# EAGLE design Can_Van_Psa (EAGLE 9.5.1)

## Sheet 1 of 3
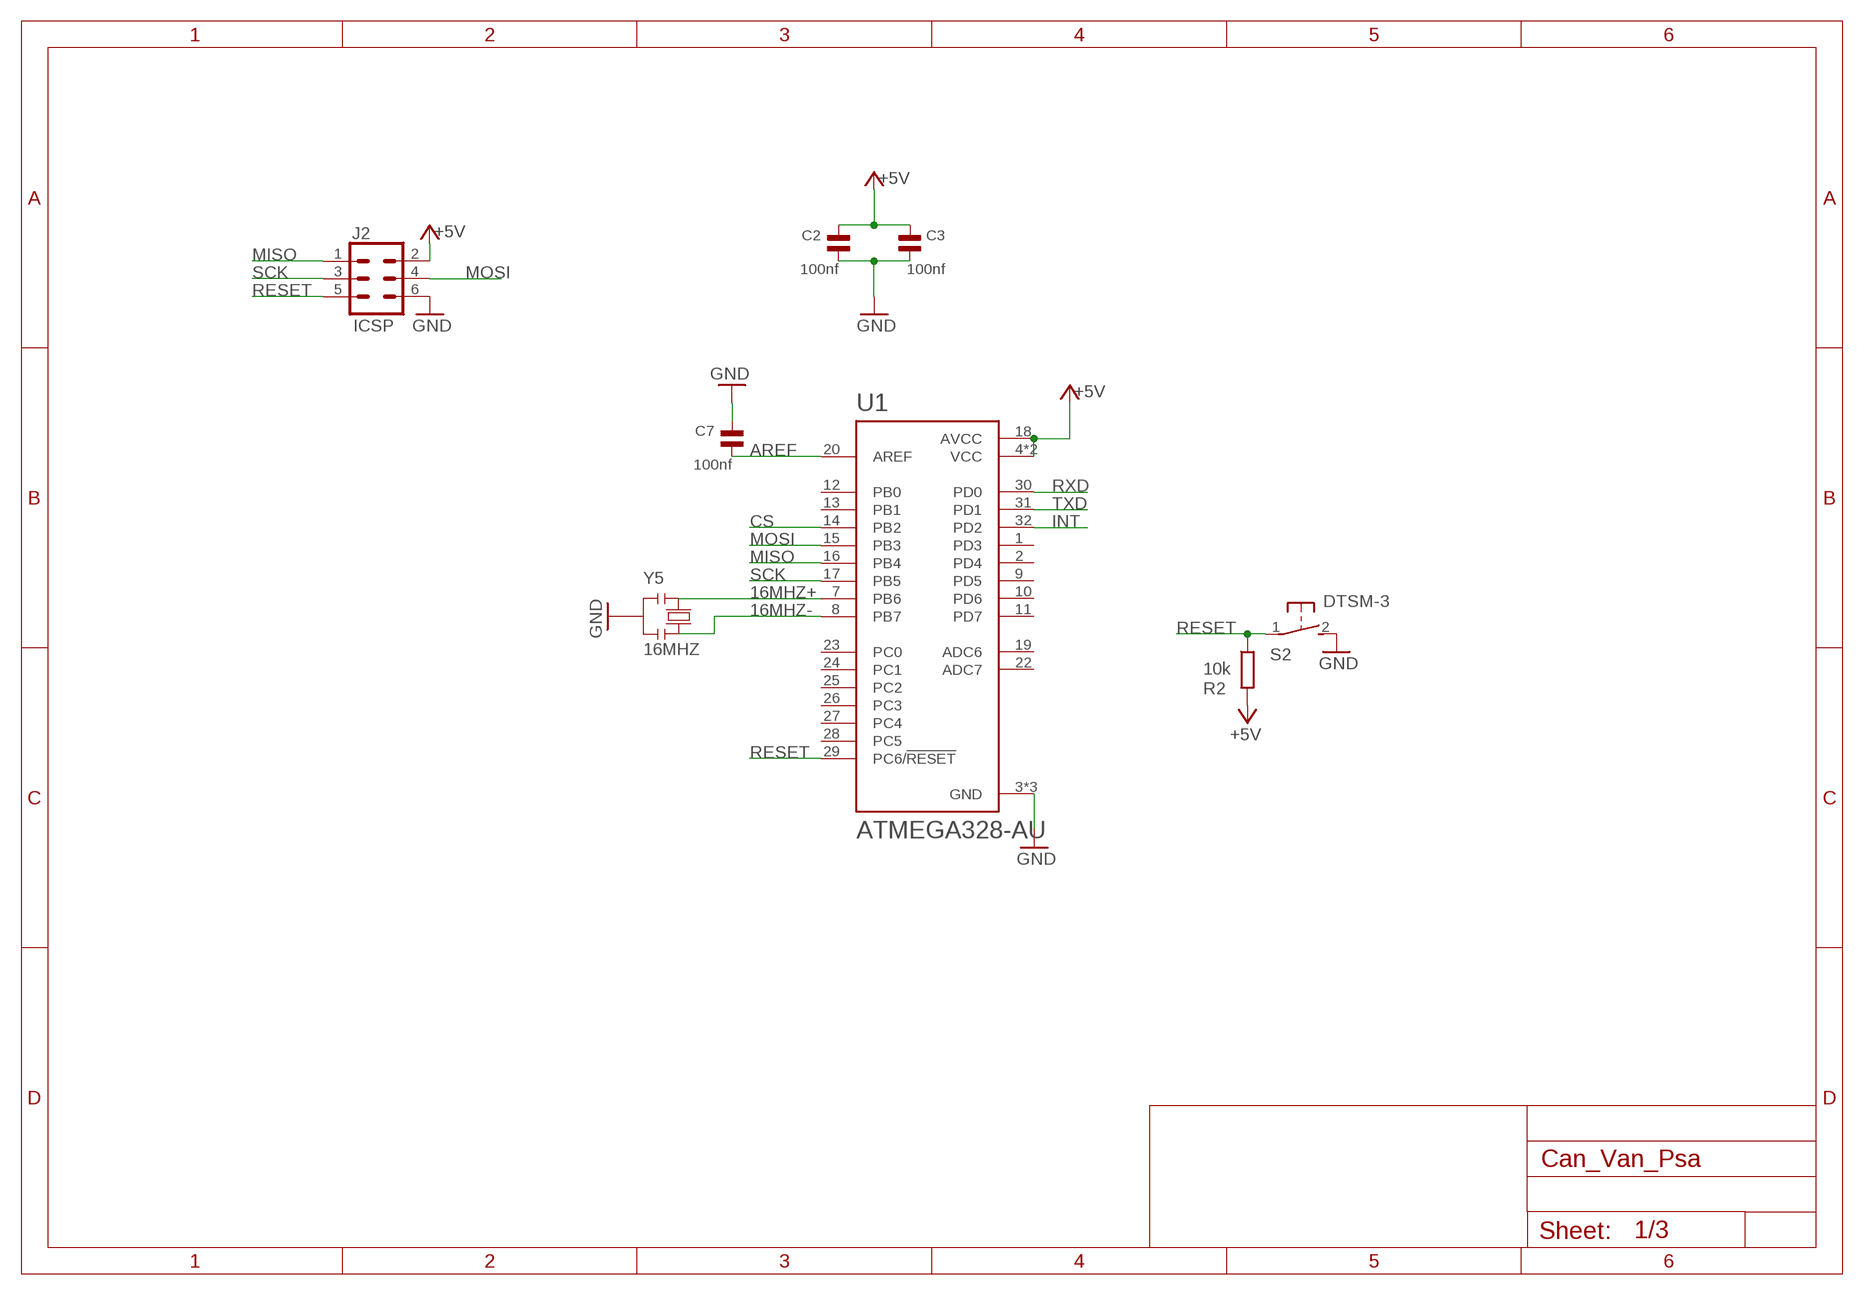
[diagram p0: schematic, sheet 1]

### Parts
C2  100nf  C0805  [0805]
C3  100nf  C0805  [0805]
C7  100nf  C0805  [0805]
J2  ICSP  CONN_03X22X3_SILK_MALE_PTH  [2X3]
R2  10k  R-EU_R0805  [R0805]
S2  DTSM-3  [DTSM-3]
U1  ATMEGA328-AU  [QFP80P900X900X120-32N]
Y5  16MHZ  CSTCE16M0V53MU  [CSTCE16M0V53]

### Nets
16MHZ+: U1.7(PB6) Y5.1
16MHZ-: U1.8(PB7) Y5.3
+5V: C2.2 C3.2 J2.2 R2.2 U1.4(VCC) U1.6(VCC) U1.18(AVCC) ; also sheet 2,3
AREF: C7.1 U1.20(AREF)
CS: U1.14(PB2) ; also sheet 3
GND: C2.1 C3.1 C7.2 J2.6 S2.2 U1.3(GND) U1.5(GND) U1.21(GND) Y5.2 ; also sheet 2,3
INT: U1.32(PD2) ; also sheet 3
MISO: J2.1 U1.16(PB4) ; also sheet 3
MOSI: J2.4 U1.15(PB3) ; also sheet 3
RESET: J2.5 R2.1 S2.1 U1.29(PC6/!RESET) ; also sheet 2
RXD: U1.30(PD0) ; also sheet 2
SCK: J2.3 U1.17(PB5) ; also sheet 3
TXD: U1.31(PD1) ; also sheet 2
Unconnected: U1.1(PD3) U1.2(PD4) U1.9(PD5) U1.10(PD6) U1.11(PD7) U1.12(PB0) U1.13(PB1) U1.19(ADC6) U1.22(ADC7) U1.23(PC0) U1.24(PC1) U1.25(PC2) U1.26(PC3) U1.27(PC4) U1.28(PC5)

## Sheet 2 of 3
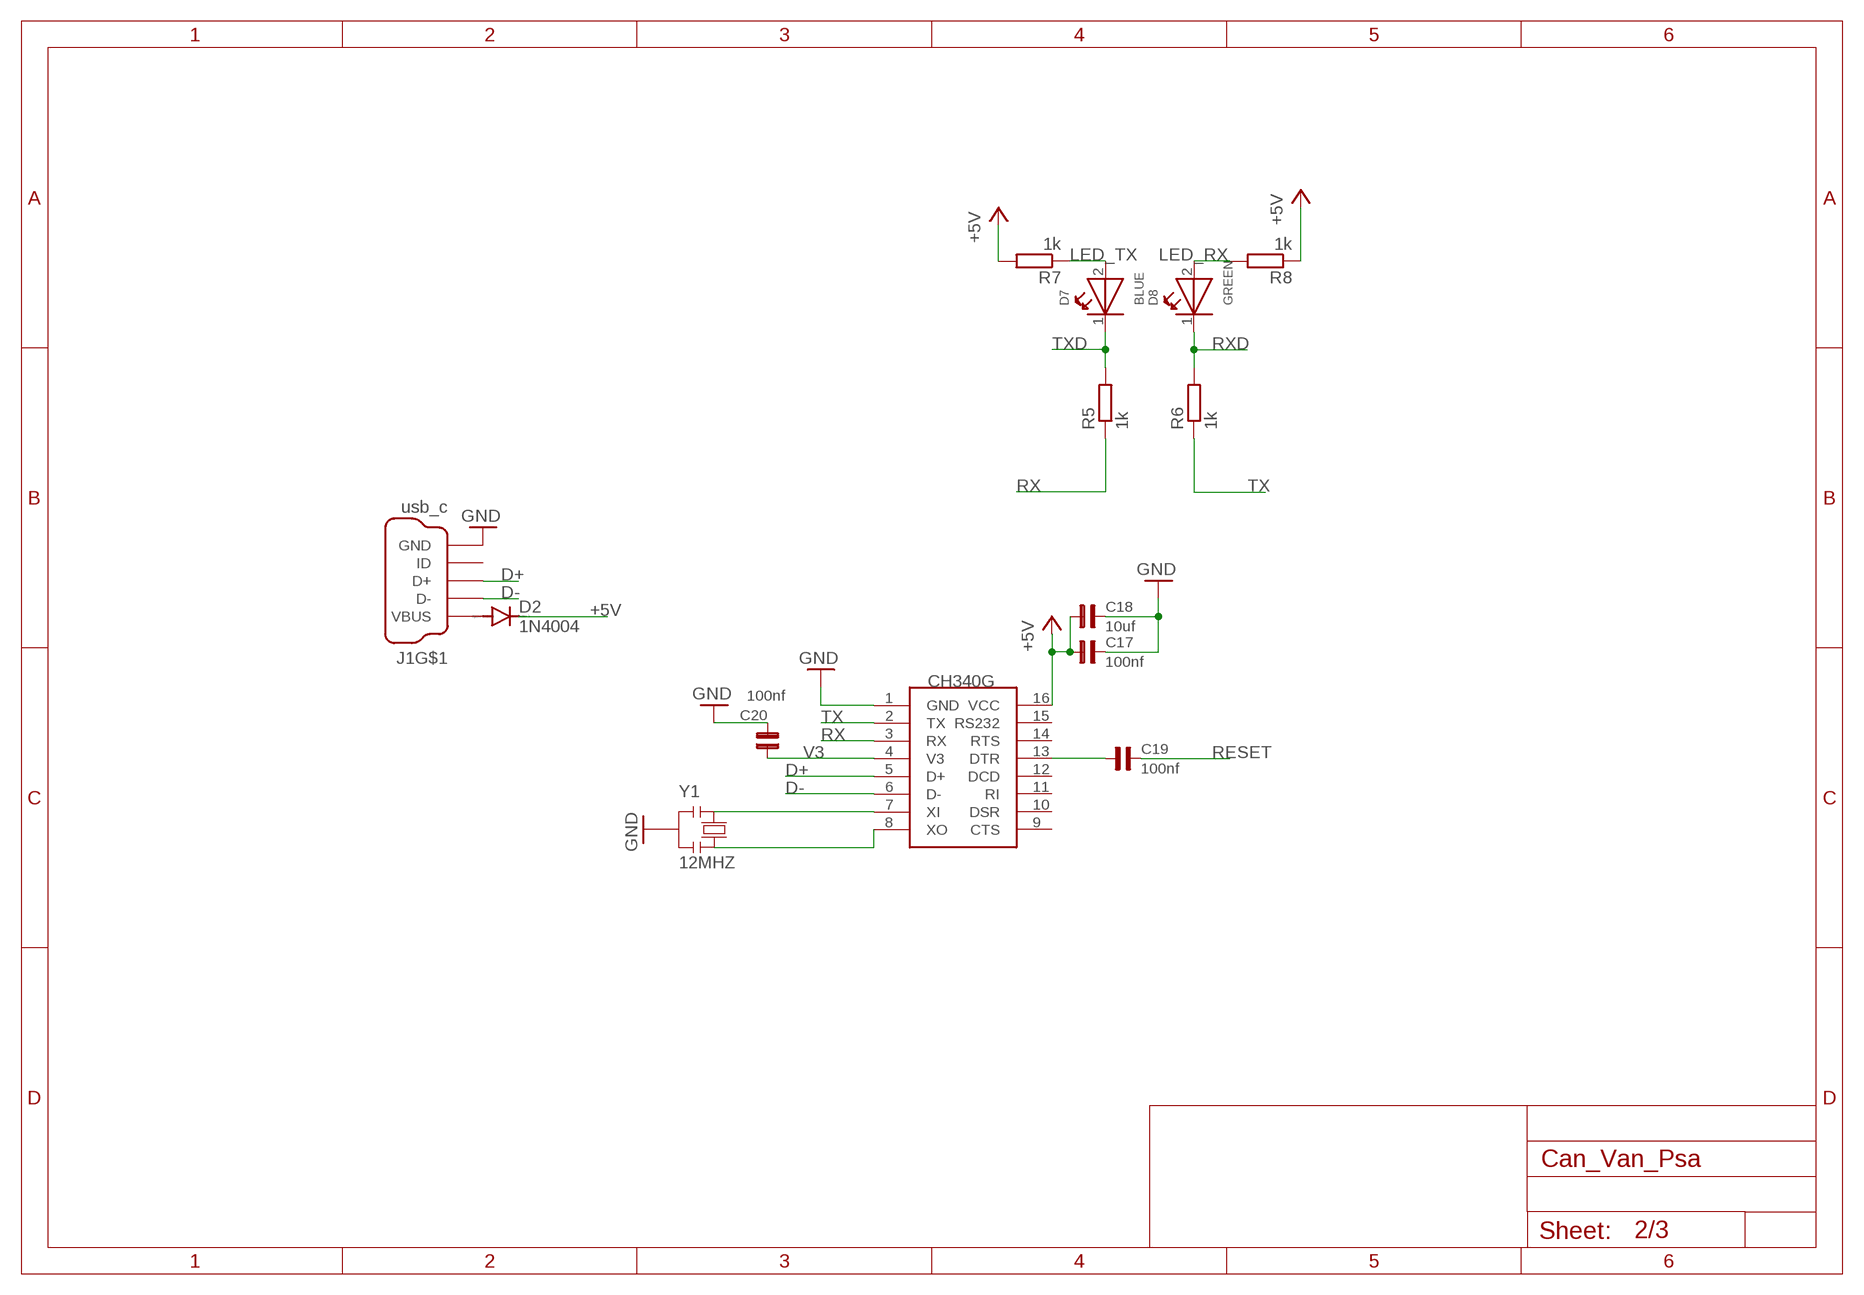
[diagram p1: schematic, sheet 2]

### Parts
C17  100nf  C0805  [0805]
C18  10uf  C0805  [0805]
C19  100nf  C0805  [0805]
C20  100nf  C0805  [0805]
D2  1N4004  DIODE-DO214AA  [DO214AA]
D7  BLUE  WL-SMCW-150080RS75000-R  [0805]
D8  GREEN  WL-SMCW-150080RS75000-R  [0805]
J1  usb_c  0548190519  [MOLEX_0548190519]
R5  1k  R-EU_R0805  [R0805]
R6  1k  R-EU_R0805  [R0805]
R7  1k  R-EU_R0805  [R0805]
R8  1k  R-EU_R0805  [R0805]
U$1  CH340G  [SOIC16]
Y1  12MHZ  CSTCE16M0V53MU  [CSTCE16M0V53]

### Nets
+5V: C17.1 C18.1 D2.C R7.2 R8.1 U$1.16(VCC) ; also sheet 1,3
D+: J1.3(D+) J1.8(D+) U$1.5(D+)
D-: J1.2(D-) J1.7(D-) U$1.6(D-)
GND: C17.2 C18.2 C20.2 J1.5(GND) J1.10(GND) U$1.1(GND) Y1.2 ; also sheet 1,3
LED_RX: D8.2(A) R8.2
LED_TX: D7.2(A) R7.1
N$4: D2.A J1.1(VBUS) J1.6(VBUS)
N$7: U$1.7(XI) Y1.1
N$8: C19.1 U$1.13(DTR)
N$11: U$1.8(XO) Y1.3
RESET: C19.2 ; also sheet 1
RX: R5.1 U$1.3(RX)
RXD: D8.1(K) R6.2 ; also sheet 1
TX: R6.1 U$1.2(TX)
TXD: D7.1(K) R5.2 ; also sheet 1
V3: C20.1 U$1.4(V3)
Unconnected: J1.4(ID) J1.9(ID) J1.11(S1) J1.12(S1) J1.S1 J1.S2(S1) U$1.9(CTS) U$1.10(DSR) U$1.11(RI) U$1.12(DCD) U$1.14(RTS) U$1.15(RS232)

## Sheet 3 of 3
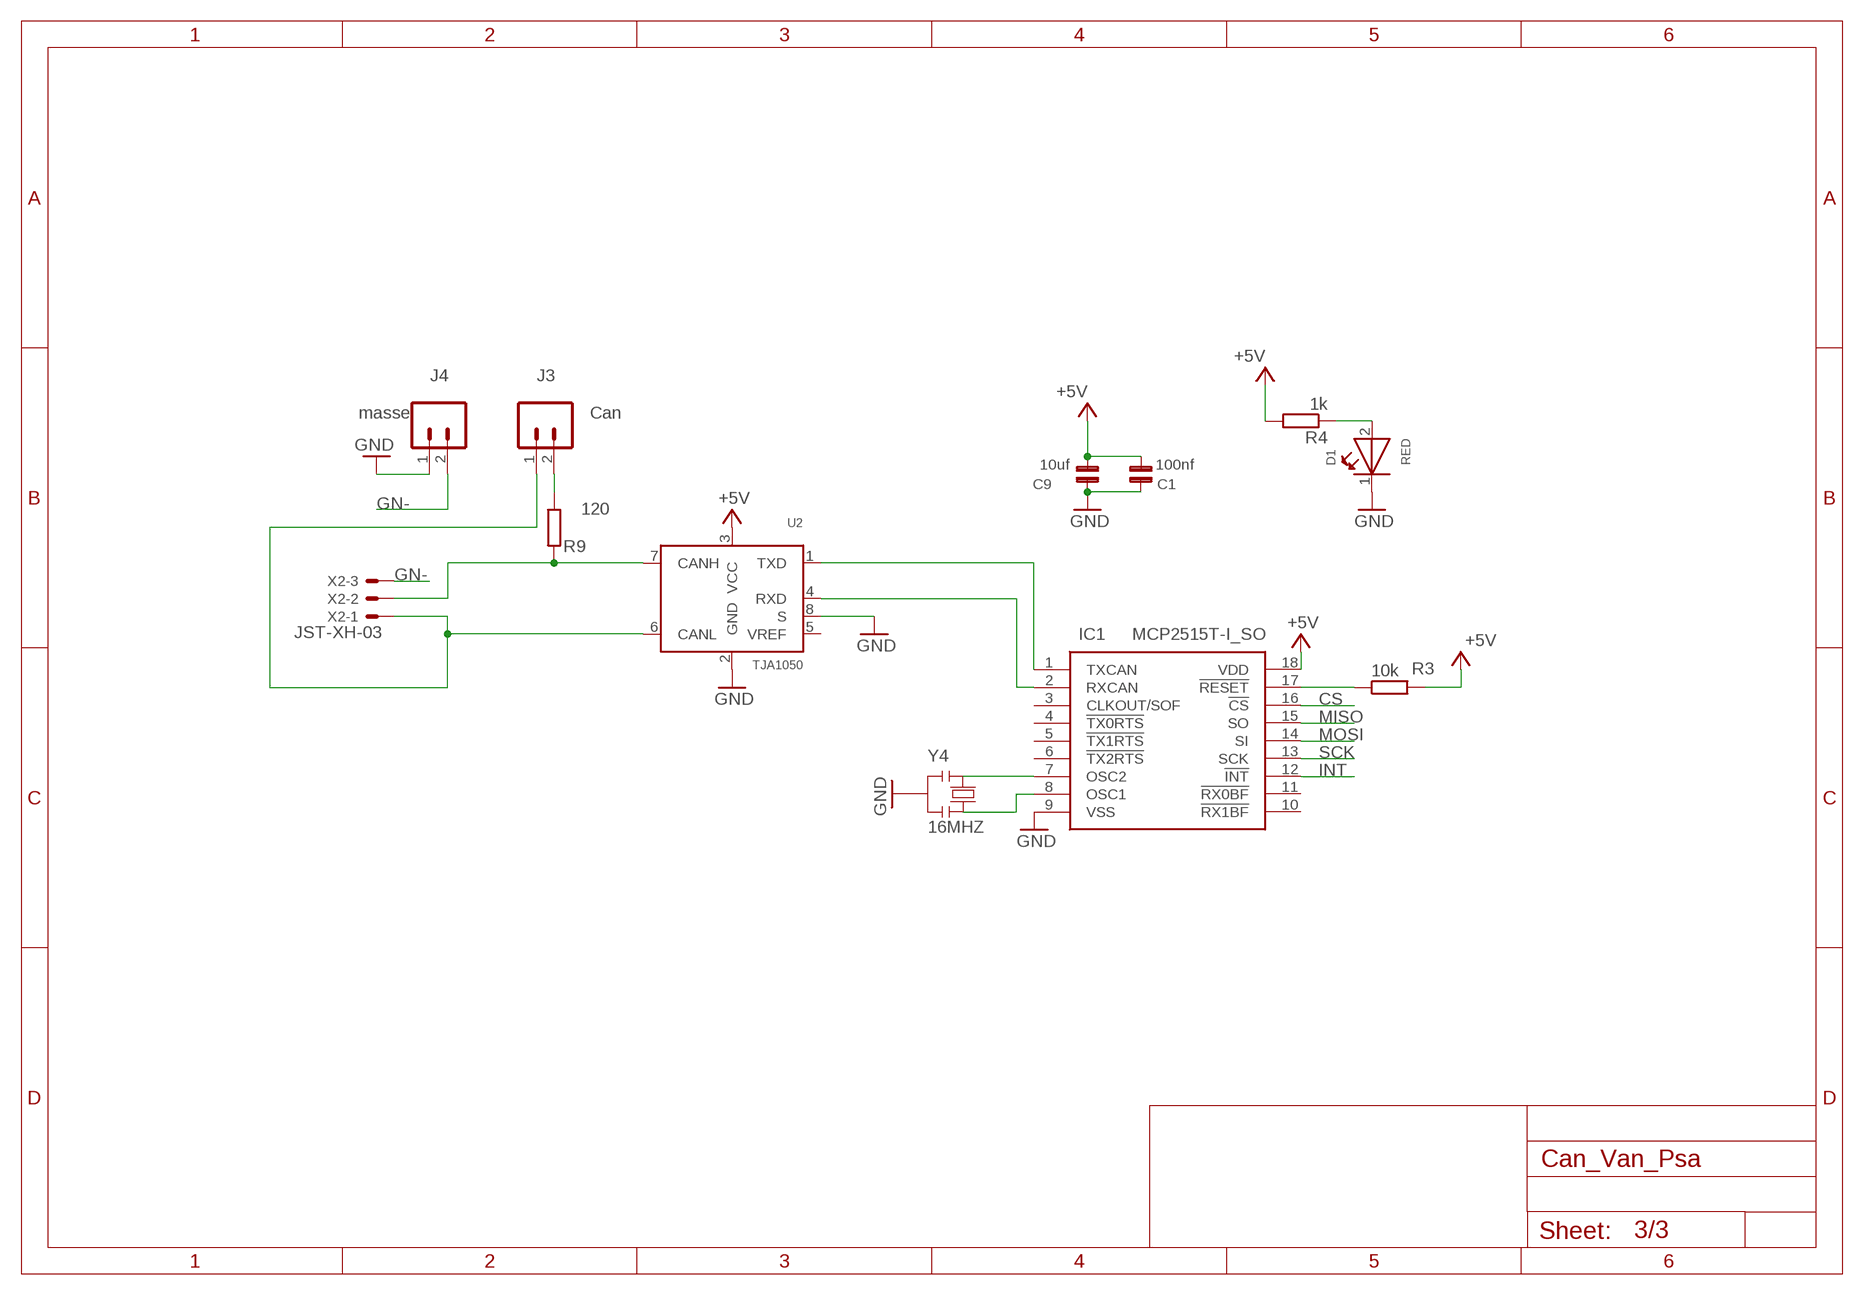
[diagram p2: schematic, sheet 3]

### Parts
C1  100nf  C0805  [0805]
C9  10uf  C0805  [0805]
D1  RED  WL-SMCW-150080RS75000-R  [0805]
IC1  MCP2515T-I_SO  [SOIC127P1030X265-18N]
J3  Can  CONN_02  [1X02]
J4  masse  CONN_02  [1X02]
R3  10k  R-EU_R0805  [R0805]
R4  1k  R-EU_R0805  [R0805]
R9  120  R-EU_R0805  [R0805]
U2  TJA1050  [SOT96-1]
X2  JST-XH-03  JST-XH-03-PIN-LONG-PAD  [JST-XH-03-PACKAGE-LONG-PAD]
Y4  16MHZ  CSTCE16M0V53MU  [CSTCE16M0V53]

### Nets
+5V: C1.2 C9.2 IC1.18(VDD) R3.2 R4.2 U2.3(VCC) ; also sheet 1,2
CS: IC1.16(!CS) ; also sheet 1
GN-: J4.2 X2.3
GND: C1.1 C9.1 D1.1(K) IC1.9(VSS) J4.1 U2.2(GND) U2.8(S) Y4.2 ; also sheet 1,2
INT: IC1.12(!INT) ; also sheet 1
MISO: IC1.15(SO) ; also sheet 1
MOSI: IC1.14(SI) ; also sheet 1
N$1: IC1.1(TXCAN) U2.1(TXD)
N$2: IC1.2(RXCAN) U2.4(RXD)
N$3: J3.2 R9.1
N$5: IC1.17(!RESET) R3.1
N$6: D1.2(A) R4.1
N$9: R9.2 U2.7(CANH) X2.2
N$10: J3.1 U2.6(CANL) X2.1
N$12: IC1.7(OSC2) Y4.1
N$13: IC1.8(OSC1) Y4.3
SCK: IC1.13(SCK) ; also sheet 1
Unconnected: IC1.3(CLKOUT/SOF) IC1.4(!TX0RTS) IC1.5(!TX1RTS) IC1.6(!TX2RTS) IC1.10(!RX1BF) IC1.11(!RX0BF) U2.5(VREF)

## Library data of the parts
C1-C3 C7 C9 C17-C20 = capsmd:C0805
D1 D7 D8 = Wurth_Elektronik_Optoelectronics_rev15b(1):WL-SMCW: SMD mono-color Chip LED Characteristics Low energy consumption High reliability Low current requirement Fast switching No UV/IR radiation Smallest SMD package with exceptional brightness Top view Wide viewing angle PBC high-usage Applications Backlight for mobile and portable device keypads Indoor and outdoor message boards Flat backlight for LCDs, switches and symbols Display for industrial control systems and traffic Miniaturized color effects Pedestrian mark Optical indicators General lighting Toys <http://katalog.we-online.de/media/images/eipal/WL-SMCW_pf2.jpg> Details see: http://katalog.we-online.de/en/led/WL-SMCW?m Updated 2015-04-10 2015 (C) Wurth Elektronik; COMPANY-URL: http://www.we-online.de; CREATED-BY: Christin Otto; CREATED-DATE: APR 2013; DATASHEET-URL: http://katalog.we-online.de/en/led/WL-SMCW?m=t&sq=smcw&sp=&sp=http%3A%2F%2Fwww.we-online.de%2Fweb%2Fen%2Felectronic_components%2Fsearchpage_PBS.php%3Fsearch%3Dsmcw#vs_t2:2; MANUFACTURER: Würth Elektronik eiSos GmbH
D2 = diode:DIODE-: DIODE
IC1 = MCP2515T-I_SO:MCP2515T-I_SO: Microchip Technology MCP2515T-I/SO, CAN Controller 1Mbit/s, 18-Pin SOIC Source: Datasheet <https://datasheet.datasheetarchive.com/originals/distributors/SFDatasheet-4/sf-00090060.pdf>; ARROW_PART_NUMBER: MCP2515T-I/SO; ARROW_PRICE-STOCK: https://www.arrow.com/en/products/mcp2515t-iso/microchip-technology?region=nac; DESCRIPTION: Microchip Technology MCP2515T-I/SO, CAN Controller 1Mbit/s, 18-Pin SOIC; HEIGHT: 2.65mm; MANUFACTURER_NAME: Microchip; MANUFACTURER_PART_NUMBER: MCP2515T-I/SO; MOUSER_PART_NUMBER: 579-MCP2515T-I/SO; MOUSER_PRICE-STOCK: https://www.mouser.co.uk/ProductDetail/Microchip-Technology/MCP2515T-I-SO?qs=uMUszenkLLKzXVzy0vTLgQ%3D%3D
J1 = miniusb:0548190519: USB - mini B USB 2.0 OTG Receptacle Connector 5 Position Through Hole, Right Angle Check availability <https://pricing.snapeda.com/parts/0548190519/Molex/view-part?ref=eda>; AVAILABILITY: In Stock; CHECK_PRICES: https://www.snapeda.com/parts/0548190519/Molex/view-part/?ref=eda; DESCRIPTION: USB - mini B USB 2.0 OTG Receptacle Connector 5 Position Through Hole, Right Angle; MF: Molex; MP: 0548190519; PACKAGE: None; PRICE: None; PURCHASE-URL: https://www.snapeda.com/api/url_track_click_mouser/?unipart_id=512025&manufacturer=Molex&part_name=0548190519&search_term=mini usb; SNAPEDA_LINK: https://www.snapeda.com/parts/0548190519/Molex/view-part/?ref=snap
J2 = SparkFun-Connectors:CONN_03X2: Multi connection point. Often used as Generic Header-pin footprint for 0.1 inch spaced/style header connections You can populate with any combo of single row headers, but if you'd like an exact match, check these: Header - 2x3 (Male, 0.1") <https://www.sparkfun.com/products/12807> (PRT-12807) Header - 2x3 (Female, 0.1") <https://www.sparkfun.com/products/13010> (PRT-13010) 2x3 Pin Shrouded Header <https://www.sparkfun.com/products/10877> (PRT-10877) On any of the 0.1 inch spaced packages, you can populate with these: Break Away Headers - Straight <https://www.sparkfun.com/products/116> (PRT-00116) Break Away Male Headers - Right Angle <https://www.sparkfun.com/products/553> (PRT-00553) Female Headers <https://www.sparkfun.com/products/115> (PRT-00115) Break Away Headers - Machine Pin <https://www.sparkfun.com/products/117> (PRT-00117) Break Away Female Headers - Swiss Machine Pin <https://www.sparkfun.com/products/743> (PRT-00743) Special note: the shrouded connector mates well with our 3x2 ribbon cables: Ribbon Crimp Connector - 6-pin (2x3, Female) <https://www.sparkfun.com/products/10651> (PRT-10651) Ribbon Cable - 6 wire (15ft) <https://www.sparkfun.com/products/10646> (PRT-10646); PROD_ID: CONN-09701
J3 J4 = SparkFun-Connectors:CONN_02: Multi connection point. Often used as Generic Header-pin footprint for 0.1 inch spaced/style header connections On any of the 0.1 inch spaced packages, you can populate with these: Break Away Headers - Straight <https://www.sparkfun.com/products/116> (PRT-00116) Break Away Male Headers - Right Angle <https://www.sparkfun.com/products/553> (PRT-00553) Female Headers <https://www.sparkfun.com/products/115> (PRT-00115) Break Away Headers - Machine Pin <https://www.sparkfun.com/products/117> (PRT-00117) Break Away Female Headers - Swiss Machine Pin <https://www.sparkfun.com/products/743> (PRT-00743) For SCREWTERMINALS and SPRING TERMINALS visit here: Screw Terimnals on SparkFun.com <https://www.sparkfun.com/search/results?term=Screw+Terminals> (5mm/3.5mm/2.54mm spacing) This device is also useful as a general connection point to wire up your design to another part of your project. Our various solder wires solder well into these plated through hole pads. Hook-Up Wire - Assortment (Stranded, 22 AWG) <https://www.sparkfun.com/products/11375> (PRT-11375) Hook-Up Wire - Assortment (Solid Core, 22 AWG) <https://www.sparkfun.com/products/11367> (PRT-11367) View the entire wire category on our website here <https://www.sparkfun.com/categories/141> Special notes: Molex polarized connector foot print use with: PRT-08233 with associated crimp pins and housings. 2.54_SCREWTERM for use with PRT-10571. 3.5mm Screw Terminal footprints for PRT-08084 5mm Screw Terminal footprints for use with PRT-08432
R2-R9 = resistor:R-EU_: RESISTOR, European symbol
S2 = switch-tact:DTSM-3
U1 = ATMEGA328-AU:ATMEGA328-AU: ATmega Series 20 MHz 32 KB Flash 2 KB SRAM 8-Bit Microcontroller - TQFP-32; AVAILABILITY: Unavailable; DESCRIPTION: AVR AVR® ATmega Microcontroller IC 8-Bit 20MHz 32KB _16K x 16_ FLASH 32-TQFP _7x7_; MF: Microchip; MP: ATMEGA328-AU; PACKAGE: TQFP-32 Microchip; PRICE: None
U2 = TJA1050:TJA1050: High speed CAN transceiver The TJA1050 is the interface between the Controller Area Network (CAN) protocol controller and the physical bus. The device provides differential transmit capability to the bus and differential receive capability to the CAN controller. The TJA1050 is the third Philips high-speed CAN transceiver after the PCA82C250 and the PCA82C251. The most important differences are: Much lower electromagnetic emission due to optimal matching of the output signals CANH and CANL Improved behaviour in case of an unpowered node No standby mode. This makes the TJA1050 eminently suitable for use in nodes that are in a power-down situation in partially powered networks. AAL Eindhoven MK Check availability <https://pricing.snapeda.com/parts/TJA1050/NXP%20Semiconductors/view-part?ref=eda>; AVAILABILITY: In Stock; CHECK_PRICES: https://www.snapeda.com/parts/TJA1050/NXP+Semiconductors/view-part/?ref=eda; DESCRIPTION: CAN 1MBd Silent 5V Automotive 8-Pin SO T/R; MF: NXP Semiconductors; MP: TJA1050; PACKAGE: None; PRICE: None; SNAPEDA_LINK: https://www.snapeda.com/parts/TJA1050/NXP+Semiconductors/view-part/?ref=snap
U$1 = ch340g:CH340G
X2 = Rembrandt Electronics - JST XH Connectors v1-0:JST-XH-03-PIN: JST XH Connector 2 Pin Wire to board connector. Pitch: 2,54 mm, (0.100") Number of pins: 3 Created by Rembrandt Electronics www.rembrandtelectronics.com
Y1 Y4 Y5 = CSTCE16M0V53:CSTCE16M0V53: CSTCE16M0V53 Ceramic Resonator (CERALOCK) 16 MHz Chip Type; AVAILABILITY: Unavailable; DESCRIPTION: CERALOCK 16.000MHz +/-5% 15pF; MF: Murata Electronics; MP: CSTCE16M0V53; PACKAGE: SMD-3 Murata Electronics; PRICE: None

## Board
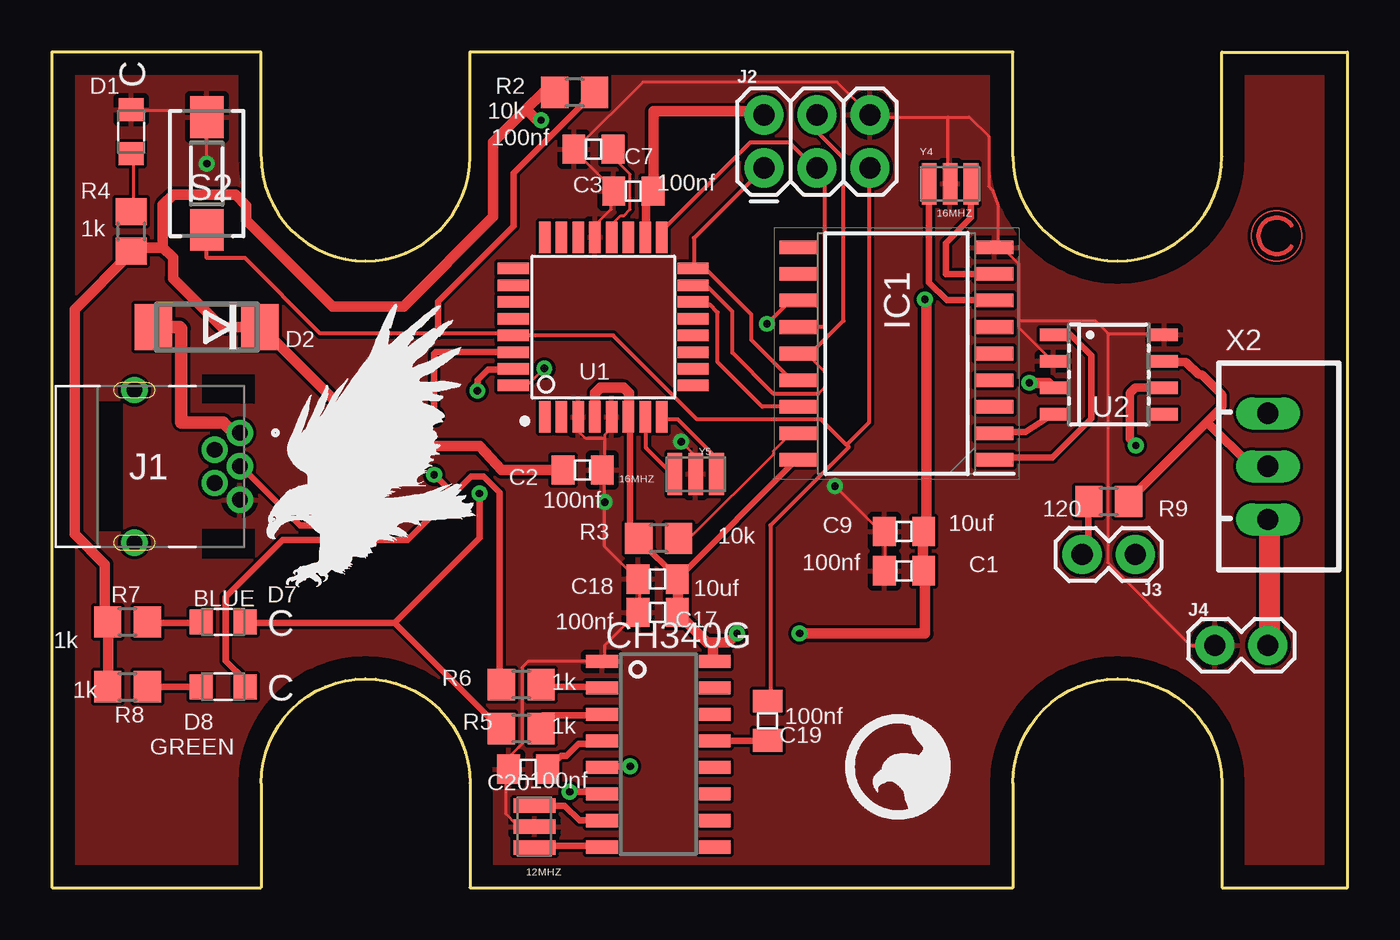
[diagram p3: board, top side]
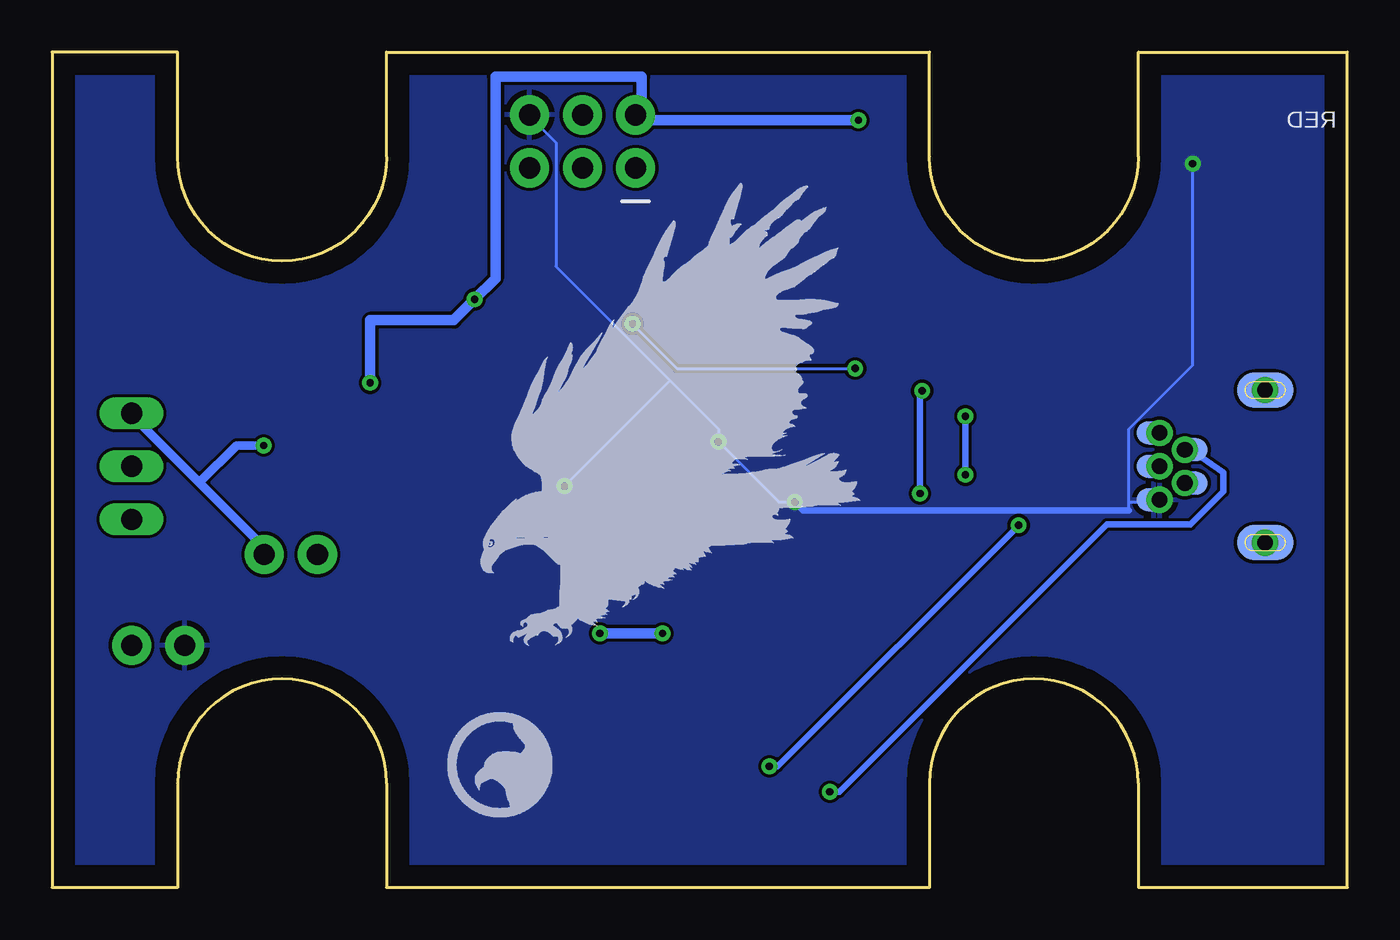
[diagram p4: board, bottom side, seen from below]

Size 62 x 40 mm. Coordinates in mm from the lower left corner, seen from the top.
Outline: 0,0 0,40 10,40 10,35 arc180 20,35 20,40 46,40 46,35 arc180 56,35 56,40 62,40 62,0 56,0 56,5 arc180 46,5 46,0 20,0 20,5 arc180 10,5 10,0 0,0
Copper layers (1*16): Top 0.035mm / dielectric 1.5mm / Bottom 0.035mm
Design rules "default": minimum track width 6mil, minimum drill 0.35mm, track to track 6mil, track to pad 6mil, pad to pad 6mil, via to via 6mil, smd to smd 6mil, copper to edge 40mil, drill to drill 6mil, minimum pad ring 10mil, minimum via ring 8mil, stop-mask expansion 4mil, vias tented up to drill 0mil, thermal gap 10mil

### Footprints (pad centres in the part's own frame; a part is rotated, then mirrored left to right if it is on the bottom)
0805 = smd 1.092 x 1.397: 1 -0.94,0; 2 0.94,0
0805' = smd 1.1 x 1.2: 1 -1.05,0; 2 1.05,0
DO214AA = smd 1.8 x 2.2: A 2.55,0; C -2.55,0
SOIC127P1030X265-18N = smd 1.85 x 0.65: 1 -4.675,5.08; 2 -4.675,3.81; 3 -4.675,2.54; 4 -4.675,1.27; 5 -4.675,0; 6 -4.675,-1.27; 7 -4.675,-2.54; 8 -4.675,-3.81; 9 -4.675,-5.08; 10 4.675,-5.08; 11 4.675,-3.81; 12 4.675,-2.54; 13 4.675,-1.27; 14 4.675,0; 15 4.675,1.27; 16 4.675,2.54; 17 4.675,3.81; 18 4.675,5.08
MOLEX_0548190519 = smd 1.1 x 1.65 bottom: 1 -1.6,0.275; 2 -0.8,-1.475; 3 0,0.275; 4 0.8,-1.475; 5 1.6,0.275 | drill 0.75 pad 0.95: 6 -1.6,0; 7 -0.8,-1.2; 8 0,0; 9 0.8,-1.2; 10 1.6,0; 11 -3.65,-5.05; 12 3.65,-5.05 | smd 1.7 x 2.7 bottom: S1 -3.65,-5.05; S2 3.65,-5.05
2X3 = drill 1.016 pad 1.88: 1 0,0; 2 0,2.54; 3 2.54,0; 4 2.54,2.54; 5 5.08,0; 6 5.08,2.54
1X02 = drill 1.016 pad 1.88: 1 0,0; 2 2.54,0
R0805 = smd 1.3 x 1.5: 1 -0.95,0; 2 0.95,0
DTSM-3 = smd 2 x 1.6: 1 -2.7,0; 2 2.7,0
QFP80P900X900X120-32N = smd 1.5 x 0.55: 1 -4.3,2.8; 2 -4.3,2; 3 -4.3,1.2; 4 -4.3,0.4; 5 -4.3,-0.4; 6 -4.3,-1.2; 7 -4.3,-2; 8 -4.3,-2.8; 17 4.3,-2.8; 18 4.3,-2; 19 4.3,-1.2; 20 4.3,-0.4; 21 4.3,0.4; 22 4.3,1.2; 23 4.3,2; 24 4.3,2.8 | smd 0.55 x 1.5: 9 -2.8,-4.3; 10 -2,-4.3; 11 -1.2,-4.3; 12 -0.4,-4.3; 13 0.4,-4.3; 14 1.2,-4.3; 15 2,-4.3; 16 2.8,-4.3; 25 2.8,4.3; 26 2,4.3; 27 1.2,4.3; 28 0.4,4.3; 29 -0.4,4.3; 30 -1.2,4.3; 31 -2,4.3; 32 -2.8,4.3
SOT96-1 = smd 0.6 x 1.3: 1 -1.905,-2.65; 2 -0.635,-2.65; 3 0.635,-2.65; 4 1.905,-2.65; 5 1.905,2.65; 6 0.635,2.65; 7 -0.635,2.65; 8 -1.905,2.65
SOIC16 = smd 0.635 x 1.524: 1 -4.445,-2.695; 2 -3.175,-2.695; 3 -1.905,-2.695; 4 -0.635,-2.695; 5 0.635,-2.695; 6 1.905,-2.695; 7 3.175,-2.695; 8 4.445,-2.695; 9 4.445,2.695; 10 3.175,2.695; 11 1.905,2.695; 12 0.635,2.695; 13 -0.635,2.695; 14 -1.905,2.695; 15 -3.175,2.695; 16 -4.445,2.695
JST-XH-03-PACKAGE-LONG-PAD = drill 1.016 long: 1 -2.54,0; 2 0,0; 3 2.54,0
CSTCE16M0V53 = smd 0.7 x 2: 1 0.45,1.688; 2 1.45,1.688; 3 2.45,1.688

### Placement (x,y rotation side)
C1  40.78,15.17 0 top
C2  25.39,19.99 180 top
C3  27.82,33.35 0 top
C7  25.91,35.35 180 top
C9  40.78,17.05 0 top
C17  28.98,13.17 180 top
C18  28.98,14.77 180 top
C19  34.25,7.99 90 top
C20  22.78,5.67 180 top
D1  RED  [0805']  3.78,36.19 270 top
D2  7.4,26.84 180 top
D7  BLUE  [0805']  8.18,12.72 180 top
D8  GREEN  [0805']  8.18,9.62 180 top
IC1  40.42,25.57 180 top
J1  8.98,20.17 270 top
J2  34.07,34.46 0 top
J3  51.85,15.95 180 top
J4  55.66,11.6 0 top
R2  25.01,38.07 180 top
R3  29.03,16.72 180 top
R4  3.78,31.42 270 top
R5  22.45,7.62 180 top
R6  22.45,9.72 180 top
R7  3.61,12.72 180 top
R8  3.61,9.62 0 top
R9  50.58,18.49 0 top
S2  7.4,34.19 90 top
U1  26.38,26.84 90 top
U2  50.58,24.57 270 top
U$1  29.02,6.39 270 top
U$2  [CS-2016-LOGO-5MM]  37.08,2.37 0 top
U$3  [CS-2016-LOGO-5MM]  37.08,2.37 0 top
U$5  [EAGLE-PLC-15MM]  41.48,11.57 0 bottom
U$6  [COPYRIGHT-2.4MM]  57.38,29.97 0 top
U$7  [COPYRIGHT-2.4MM]  57.38,29.97 0 top
U$8  [EAGLE-PLC-10MM]  10.28,14.37 0 top
U$9  [EAGLE-PLC-15MM]  38.28,13.37 0 bottom
U$10  [CS-2016-LOGO-5MM]  43.98,2.47 0 bottom
X2  58.2,20.17 270 top
Y1  21.4,4.37 270 top
Y4  41.53,32.01 0 top
Y5  29.35,18.11 0 top

### Tracks (layer width: path | path; a pad name or v marks a point on that pad's centre or on a via)
16MHZ+
  Top 0.152: 28.43,22.42 U1.7 | 29.65,19.83 Y5.1
  Top 0.2: 28.43,22.42 28.43,21.05 29.65,19.83
16MHZ-
  Top 0.152: 29.19,22.42 U1.8 | 31.78,19.83 Y5.3
  Top 0.2: 29.19,22.42 29.96,22.42 31.78,20.59 31.78,19.83
+5V  (via drill 0.35)
  Top 0.152: 2.68,9.77 R8.1 | 2.68,12.67 R7.2 2.52,12.82 | 9.99,26.84 D2.C | 3.9,30.35 R4.2 | 24.01,37.97 R2.2 | 3.74,30.35 R4.2 | 28.74,33.17 28.74,33.24 C3.2 | 28.43,31.26 U1.18 | 28.89,33.39 C3.2 | 47.79,23.79 U2.3 47.7,24.17 | 41.84,17.09 C9.2 41.69,16.93 | 41.69,15.26 C1.2 41.69,15.11 | 25.99,22.57 U1.4 | 29.96,13.28 C17.1 29.96,13.12 | 29.96,14.65 C18.1 29.96,14.8 | 28.13,16.63 R3.2 27.97,16.78 27.67,17.09 | 31.63,10.84 U$1.16 31.78,10.69 | 35.59,20.44 IC1.18 | 27.67,22.42 U1.6 | 41.69,14.8 41.69,15.11 | 34.07,37.05 J2.2 34.07,36.9 | R4.2 3.96,30.65 | C3.2 28.78,33.37 | 41.78,15.02 41.69,15.11 | 41.84,28.11 v41.78,28.17
  Top 0.3: 28.13,16.63 29.96,14.8 35.59,20.44 | 31.35,11.73 31.63,11.45 | 27.67,17.09 27.67,22.42
  Top 0.4: 28.74,33.17 28.43,32.87 28.43,31.26
  Top 0.5: 2.68,12.67 2.68,9.77 | 9.99,26.84 15.7,21.13 20.46,21.13 21.52,19.99 C2.2 | D2.C 8.11,26.84 5.78,29.17 5.78,30.17 5.3,30.65 | R2.2 23.49,38.07 22.68,37.27 | 22.68,37.27 21.12,35.7 21.12,32.13 16.81,27.82 13.42,27.82 9.29,31.96 9.29,32.66 8.78,33.17 5.78,33.17 5.3,32.69 5.3,30.65 | 2.52,12.82 2.52,15.48 1.07,16.93 1.07,27.67 3.74,30.35 | 41.69,16.93 41.69,15.26 | 25.99,22.57 25.99,23.68 26.25,23.94 27.36,23.94 27.62,23.68 27.62,22.58 U1.6 | 29.96,14.65 29.96,13.28 | 31.63,11.45 31.63,10.84 | 29.96,13.12 31.35,11.73 32.34,11.73 v32.78,12.17 | 3.96,30.65 5.3,30.65 | v23.41,36.75 23.2,36.75 22.68,37.27 | 28.78,33.37 28.78,37.17 33.8,37.17 34.07,36.9 | v35.78,12.17 41.78,12.17 41.78,15.02 | 41.84,17.09 41.84,28.11 | v46.78,24.17 47.7,24.17
  Bottom 0.152: 33.92,36.75 34.07,36.9 J2.2 33.78,37.29
  Bottom 0.5: 33.92,36.75 v23.41,36.75 | v32.78,12.17 v35.78,12.17 | 33.78,37.29 33.78,38.83 40.78,38.83 40.78,29.17 v41.78,28.17 42.78,27.17 46.78,27.17 v46.78,24.17
AREF
  Top 0.152: C7.1 26.91,35.22 26.91,34.92 27.67,34.16 27.67,32.48 27.36,32.17 27.21,32.17 26.91,31.87 26.91,31.26 U1.20
CS
  Top 0.152: 30.72,27.91 U1.14
  Top 0.2: 30.72,27.91 31.48,27.91 31.85,27.54 31.85,25.16 33.98,23.03 IC1.16
D+  (via drill 0.35)
  Top 0.152: 26.45,5.81 U$1.5
  Top 0.3: v27.67,5.81 26.45,5.81 | v15.73,17.35 11.86,17.35 9.08,20.13 J1.8
  Bottom 0.152: J1.3 9.23,20.29 9.08,20.29 J1.8
  Bottom 0.3: v27.67,5.81 27.27,5.81 v15.73,17.35
D-  (via drill 0.35)
  Top 0.152: 26.3,4.59 U$1.6
  Top 0.3: v24.77,4.59 26.3,4.59
  Bottom 0.152: J1.7 7.71,21.05 7.55,21.05 J1.2
  Bottom 0.3: v24.77,4.59 24.32,4.59 11.51,17.4 7.5,17.4 5.93,18.97 5.93,19.87 J1.2
GN-
  Top 0.152: 58.3,17.54 X2.3 | 58.3,11.6 J4.2
  Top 1: 58.3,11.6 58.3,17.54
GND  (via drill 0.35)
  Top 0.152: 46.26,27.15 46.26,29.89 45.5,30.65 45.28,30.65 | 46.26,27.15 46.26,26.84 47.79,25.32 U2.2 | 45.28,30.65 IC1.9 44.43,30.65 | 50.56,26.54 50.53,26.54 50.53,15.56 54.49,11.6 J4.1 | 50.56,26.54 53.12,26.54 U2.8 | 50.56,26.54 49.95,27.15 46.26,27.15 | Y1.2 22.95,3.07 22.18,3.07 21.73,3.52 21.73,5.66 C20.2 21.88,5.81 21.88,6.27 22.49,6.88 22.49,10.53 22.79,10.84 26.3,10.84 U$1.1 26.45,10.84 26.45,11.6 27.97,13.12 C17.2 28.13,13.28 28.13,14.65 C18.2 27.97,14.8 26.45,16.32 v26.45,18.46 26.45,19.98 C2.1 26.45,20.13 26.45,21.51 | 26.45,21.51 26.45,21.66 26.76,21.96 26.76,22.42 U1.5 | 26.45,21.51 25.54,21.51 25.23,21.81 25.23,22.42 U1.3 | U1.21 25.99,31.26 25.99,31.72 26.76,32.48 26.76,33.24 C3.1 26.91,33.39 25.08,35.22 C7.2 25.08,35.37 28.28,38.58 37.58,38.58 J2.6 39.25,36.9 42.88,36.9 | D1.1 3.9,37.2 7.1,37.2 S2.2 v7.4,34.66 | C1.1 39.86,15.26 39.86,16.93 C9.1 39.57,17.12 v37.47,19.23 | v30.11,21.35 30.72,20.74 30.72,19.83 Y5.2 | 45.28,30.65 45.28,32.68 45.02,33.4 44.83,33.59 44.83,35.97 43.9,36.9 42.88,36.9 | Y4.2 42.88,33.8 42.88,36.9
  Bottom 0.152: J1.5 9.23,18.61 9.08,18.61 J1.10 9.38,18.46 10.45,18.46 | 32.39,24.25 37.88,29.74 37.88,35.68 39.1,36.9 J2.6 | 32.39,24.25 30.11,21.96 v30.11,21.35 27.21,18.46 v26.45,18.46 | v37.47,19.23 32.45,24.25 32.39,24.25 | v7.4,34.66 7.4,25.01 10.45,21.96 10.45,18.46 | 10.45,18.06 10.45,18.46
  Bottom 0.3: v26.45,18.46 26.05,18.06 10.45,18.06
  pour Top: -0.02,39.87 0.18,40.07 0.28,39.97
  pour Top: 0.08,-0.03 0.08,39.87 0.38,40.17 61.98,40.17 62.08,40.07 62.08,-0.13 0.28,-0.03
  pour Bottom: -0.02,-0.03 -0.02,40.17 0.08,40.27 61.98,40.27 61.98,-0.13 62.08,-0.23 0.18,-0.23
INT  (via drill 0.35)
  Top 0.152: v23.55,24.86 22.79,24.1 22.18,24.1 U1.32 | 35.29,28.06 35.59,28.06 IC1.12
  Top 0.2: 35.29,28.06 v34.22,26.99
  Bottom 0.152: v23.55,24.86 32.09,24.86 v34.22,26.99
LED_RX
  Top 0.152: 7.1,9.62 D8.2 | 4.66,9.62 R8.2
  Top 0.3: 4.66,9.62 7.1,9.62
LED_TX
  Top 0.152: 7.1,12.67 D7.2 | 4.66,12.67 R7.1
  Top 0.3: 4.66,12.67 7.1,12.67
MISO
  Top 0.152: 30.72,29.74 U1.16 30.72,29.58 31.33,29.58 | 35.29,24.4 35.59,24.4 IC1.15
  Top 0.2: 30.72,29.74 30.72,31.11 J2.1 | 35.29,24.4 33.46,26.23 33.46,27.45 31.33,29.58
MOSI
  Top 0.152: 31.33,28.82 30.72,28.82 U1.15 | 36.66,23.64 36.97,23.94 36.97,24.71 36.2,25.47 | 36.2,25.47 35.75,25.47 IC1.14 36.2,25.47
  Top 0.2: 31.33,28.82 32.56,27.59 32.56,25.62 34.53,23.64 36.66,23.64 | 36.2,25.47 37.88,27.15 37.88,34.92 36.66,36.14 36.66,36.9 J2.4
N$1
  Top 0.152: 45.2,20.59 IC1.1
  Top 0.3: U2.1 48.75,26.48 49.75,25.47 49.75,22.47 47.88,20.59 45.2,20.59
N$2
  Top 0.152: 45.2,21.81 IC1.2
  Top 0.3: 45.2,21.81 46.6,21.81 U2.4
N$3
  Top 0.152: 49.62,18.46 R9.1 | 49.31,16.02 J3.2
  Top 0.3: 49.62,18.46 49.62,16.32 49.31,16.02
N$4
  Top 0.152: J1.6 8.68,21.77 | 6.18,26.77 6.11,26.84
  Top 0.6: 8.68,21.77 8.18,22.27 6.18,22.27 6.18,26.77 | 6.11,26.84 D2.A
  Bottom 0.152: J1.1 9.23,21.81 9.08,21.81 J1.6
N$5
  Top 0.152: R3.1 30.11,16.78 30.57,16.78 34.53,20.74 34.53,20.9 35.29,21.66 35.59,21.66 IC1.17
N$6
  Top 0.152: D1.2 3.9,35.07 3.9,32.48 R4.1
N$7
  Top 0.3: Y1.1 24.53,3.92 25.23,3.21 U$1.7
N$8
  Top 0.152: 34.22,7.03 C19.1 | 31.78,7.03 U$1.13
  Top 0.3: 31.78,7.03 34.22,7.03
N$9
  Top 0.152: 55.03,24.55 54.88,24.55 | 53.27,25.16 U2.7 | 51.6,18.61 R9.2
  Top 0.4: 54.88,24.55 54.27,25.16 53.27,25.16 | X2.2 57.42,20.17 55.29,22.3 | 55.03,24.55 56.01,23.58 56.01,23.03 55.29,22.3 | 55.29,22.3 51.6,18.61
N$10  (via drill 0.35)
  Top 0.152: 58.15,22.73 X2.1
  Top 0.4: U2.6 51.84,23.94 51.58,23.67 51.58,21.47 v51.88,21.17
  Bottom 0.152: 51.9,16.32 51.9,16.02 J3.1 | 58.15,22.57 X2.1
  Bottom 0.4: 58.15,22.57 54.96,19.39 | 54.96,19.39 51.9,16.32 | v51.88,21.17 53.18,21.17 54.96,19.39
N$11
  Top 0.152: 26.3,2 U$1.8 | 23.1,2 Y1.3
  Top 0.3: 23.1,2 26.3,2
N$12
  Top 0.152: IC1.7 45.08,28.12
  Top 0.3: Y4.1 41.98,28.97 42.83,28.12 44.68,28.12 | 45.09,28.12 44.68,28.12 | 45.08,28.12 44.68,28.12
N$13
  Top 0.152: 44.74,29.43 44.98,29.43 | 44.98,29.43 45.04,29.43 IC1.8 | 44.92,29.37 44.98,29.43
  Top 0.3: Y4.3 43.98,32.07 42.78,30.87 42.78,29.37 44.92,29.37
RESET
  Top 0.152: 22.6,26.44 22.69,26.54 22.18,26.54 U1.29 22.03,26.54 | 25.84,37.97 R2.1 | 34.38,9.01 C19.2 | 38.13,21.1 38.03,21.2
  Top 0.2: 22.03,26.54 18.48,26.54 12.84,26.54 9.23,30.14 7.4,30.14 S2.1 | 34.38,9.01 34.38,17.34 38.13,21.1 | J2.5 39.1,34.46 39.1,22.27 38.03,21.2 36.81,22.42 30.87,22.42 26.85,26.44 22.6,26.44
  Top 0.3: 25.84,37.97 22.95,35.07 22.08,34.2 22.08,31.67 18.48,28.07 18.48,26.54
RX
  Top 0.152: 26.29,8.24 26.3,8.25 U$1.3
  Top 0.3: 26.29,8.24 23.47,8.24 R5.1
RXD  (via drill 0.35)
  Top 0.152: 9.23,9.94 9.23,9.77 D8.1 | 21.42,9.77 R6.2 | 22.18,25.62 U1.30
  Top 0.3: 9.23,9.94 8.31,10.86 8.31,13.93 11.02,16.64 17.01,16.64 19.21,18.84 | 19.21,18.84 20.05,19.68 20.66,19.68 21.42,18.92 21.42,9.77 | 19.21,18.84 v18.28,19.77 | U1.30 18.35,25.64 18.28,25.57 v18.28,22.57
  Bottom 0.3: v18.28,19.77 v18.28,22.57
SCK
  Top 0.152: 36.51,34.46 J2.3
  Top 0.2: 36.51,34.46 35.29,35.68 33.41,35.68 29.22,31.48 U1.17 | IC1.13 36.97,26.84 36.97,34.16 36.66,34.46 J2.3
TX
  Top 0.152: 23.4,9.62 R6.1 | 26.3,9.62 U$1.2
  Top 0.3: 26.3,9.62 23.4,9.62
TXD  (via drill 0.35)
  Top 0.152: 9.38,12.67 D7.1 | 21.42,7.64 R5.2 | 22.07,24.81 U1.31
  Top 0.3: 16.39,12.67 9.38,12.67 | 21.42,7.64 16.39,12.67 | 22.07,24.81 20.87,24.81 20.35,24.29 v20.35,23.79 | v20.45,18.87 20.45,16.73 16.39,12.67
  Bottom 0.152: 20.45,23.69 v20.35,23.79
  Bottom 0.3: 20.45,23.69 v20.45,18.87
V3
  Top 0.152: 26.3,6.88 U$1.4
  Top 0.3: 26.3,6.88 25.19,6.88 24.63,6.31 24.36,6.31 C20.1